# Altium project two.PrjPcb
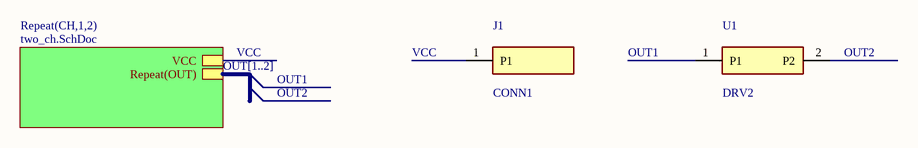
[diagram p0: two.SchDoc]
2 sheets, 6 parts. Net scope: hierarchical (ports join the sheet entries above them; power ports are global).
Sheets:
  two.SchDoc
    CH1 = two_ch.SchDoc
    CH2 = two_ch.SchDoc

## Sheet two.SchDoc
size A4

### Parts
J1  CONN1
U1  DRV2

### Sub-sheets
Repeat(CH,1,2) = two_ch.SchDoc: VCC, Repeat(OUT)

### Nets
OUT1: U1.1(P1)
OUT2: U1.2(P2)
VCC: J1.1(P1) ; sheet Repeat(CH,1,2)/VCC

### Buses and harness runs
bus OUT[1..2] = sheet Repeat(CH,1,2)/Repeat(OUT)

### Library data of the parts
J1 = CONN
U1 = DRIVER

## Sheet two_ch.SchDoc
size A4
Used 2 times, as channels CH1, CH2. Parts and nets are listed once, with the designators drawn on the sheet.
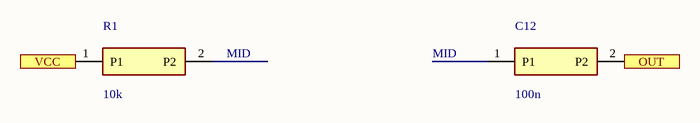
[diagram p1: two_ch.SchDoc]

### Parts
C12  100n
R1  10k

### Ports
OUT, VCC

### Nets
MID: C12.1(P1) R1.2(P2)
OUT: C12.2(P2) ; port OUT
VCC: R1.1(P1) ; port VCC

### Channels
CH1: designators end in _CH1; ports OUT=OUT1 VCC=VCC
CH2: designators end in _CH2; ports OUT=OUT2 VCC=VCC

### Library data of the parts
C12 = CAP
R1 = RES

## Nets that join several sheets
OUT1: two (U1.1), CH1 (C12_CH1.2)
OUT2: two (U1.2), CH2 (C12_CH2.2)
VCC: two (J1.1), CH1 (R1_CH1.1), CH2 (R1_CH2.1)